# EasyEDA Pro project 作业1.eprj

# Schematic Schematic1
Board Name: Board1; Create Date: 2025-07-04; Page Name: P1; Project Name: 作业1; Schematic Name: Schematic1; Update Date: 2025-07-04; Company: 嘉立创EDA; Page Size: A4; Version: V1.0
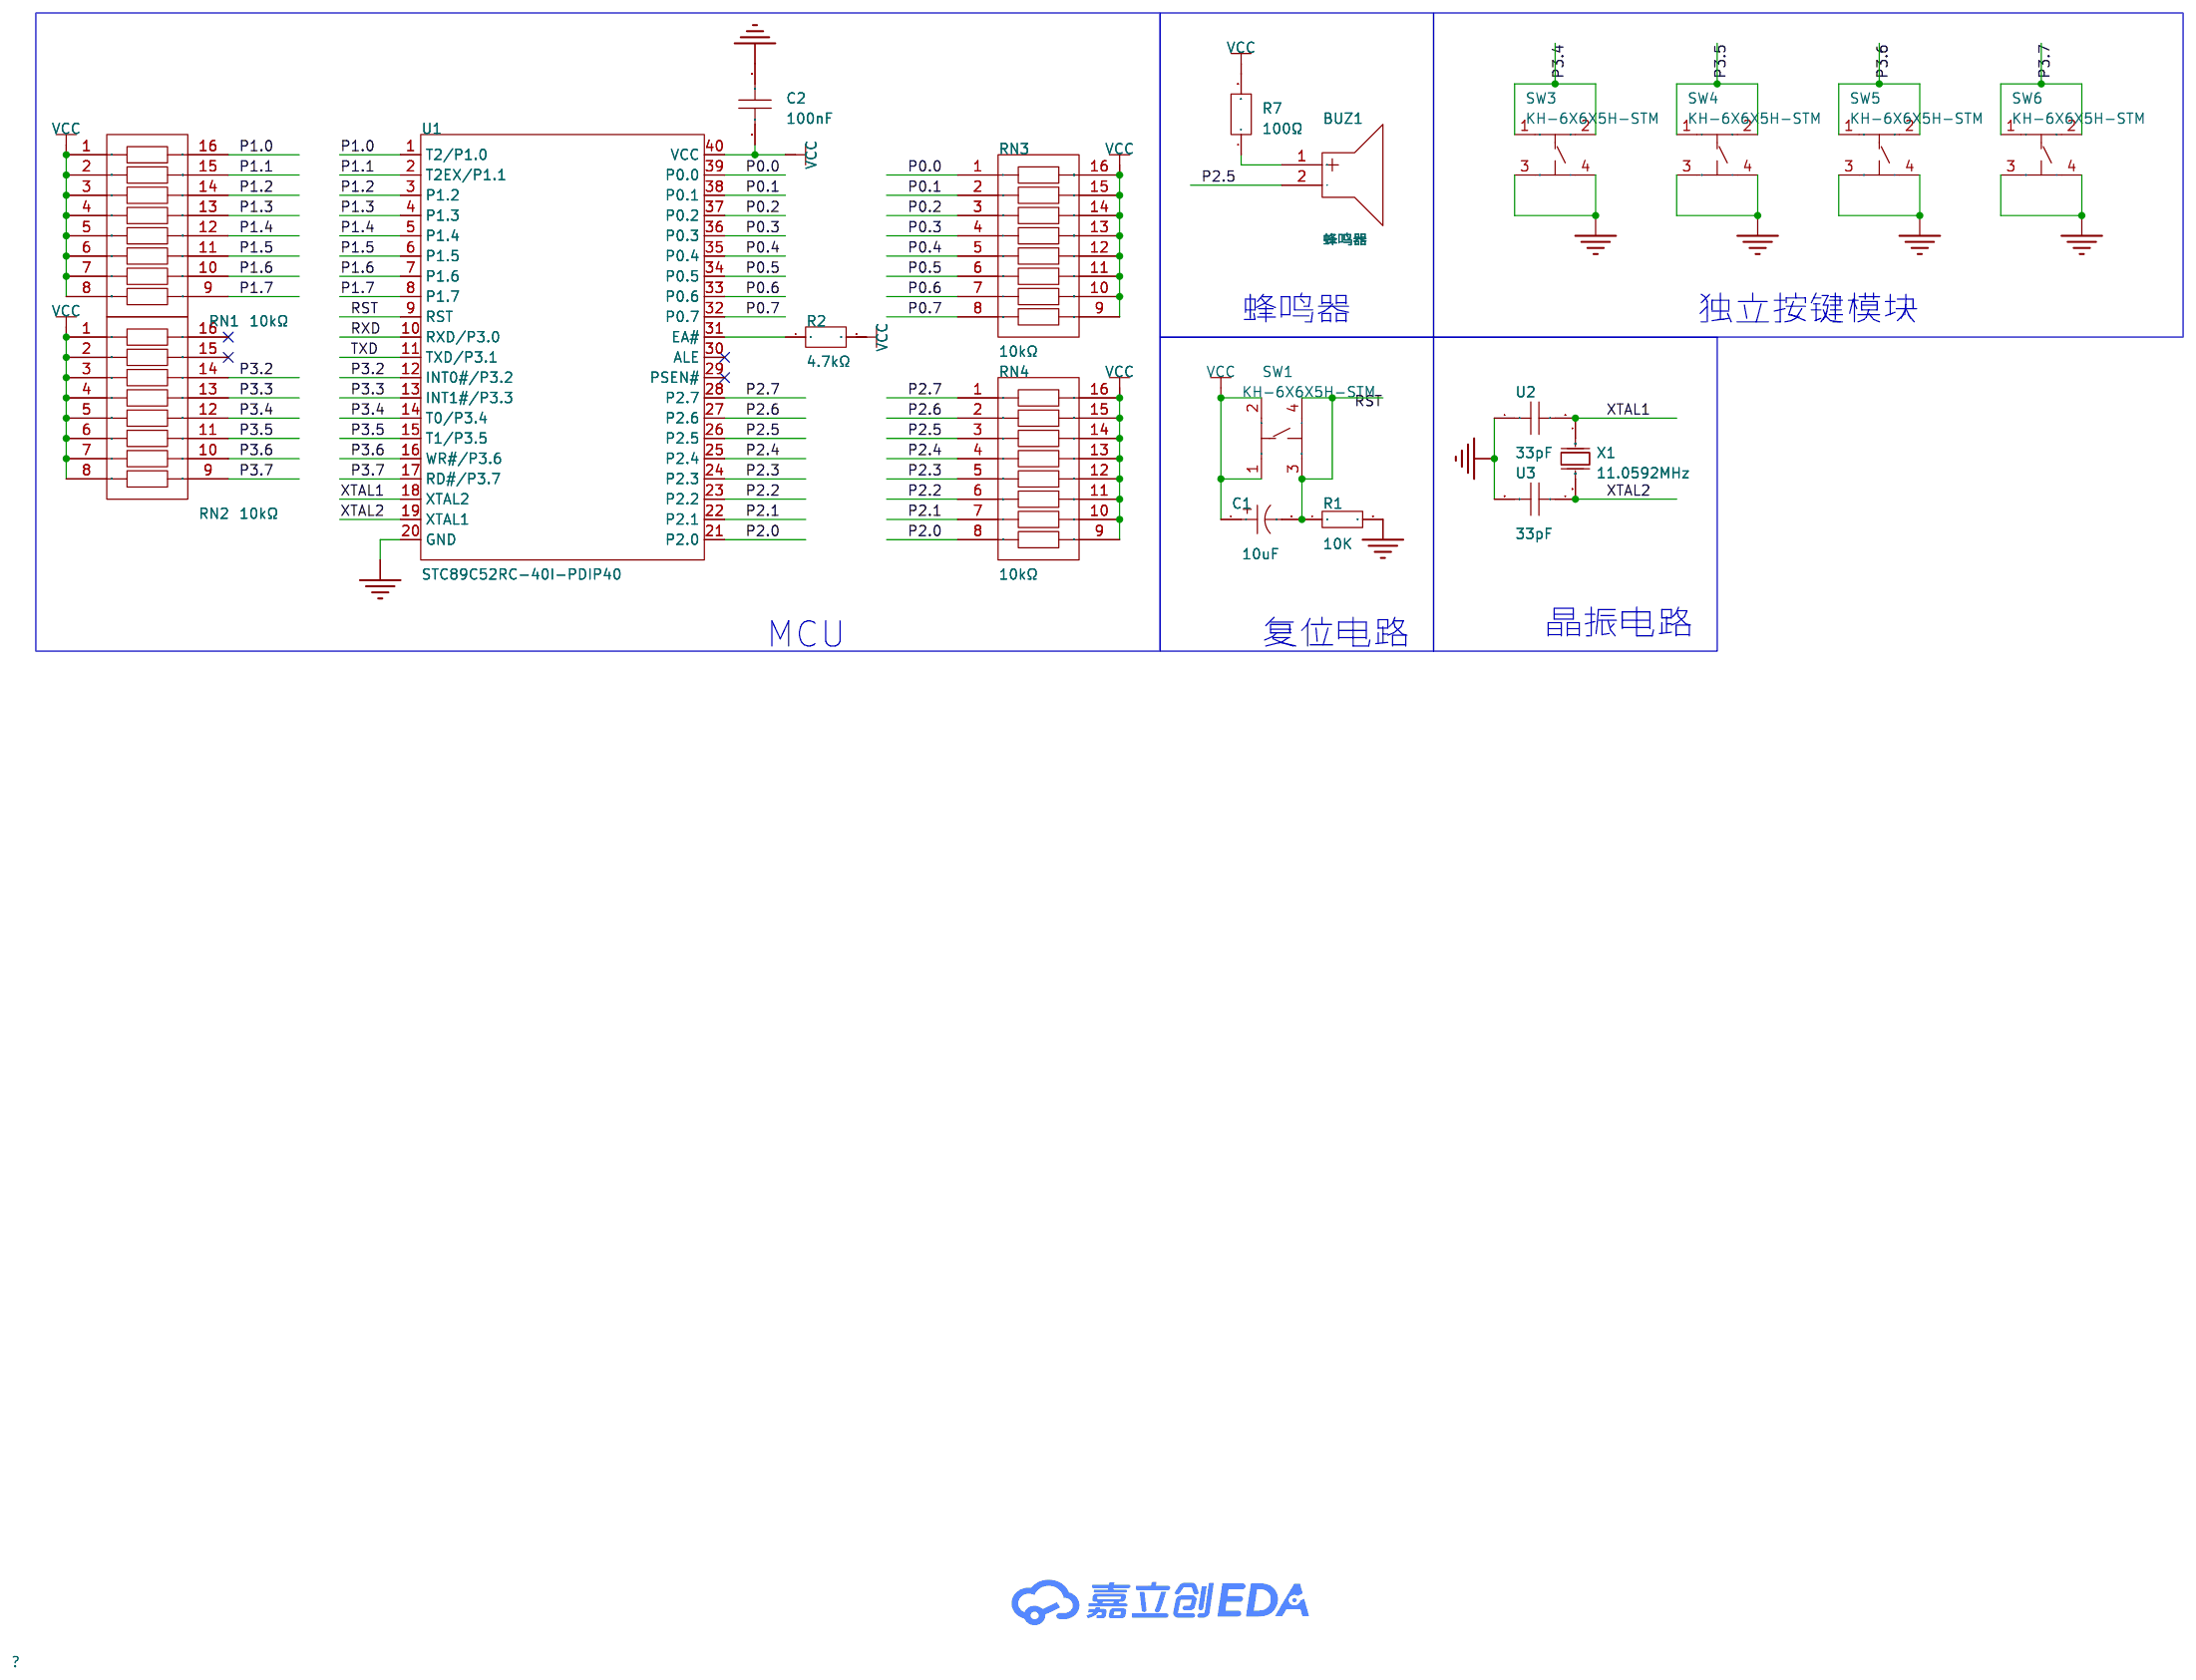
[diagram p0: schematic sheet]

## Parts
BUZ1  蜂鸣器  [BUZ-TH_BD9.0-P5.00-D0.6-FD]
C1  10uF  [CAP-TH_BD10.0-P5.00-D0.6-FD_1]
C2  100nF  [C0603]
R1  10K  [R0603]
R2  4.7kΩ  [R0805]
R7  100Ω  [R1206]
RN1  10kΩ  [DIP-16_L22.0-W6.7-P2.54-LS7.6-BL]
RN2  10kΩ  [DIP-16_L22.0-W6.7-P2.54-LS7.6-BL]
RN3  10kΩ  [DIP-16_L22.0-W6.7-P2.54-LS7.6-BL]
RN4  10kΩ  [DIP-16_L22.0-W6.7-P2.54-LS7.6-BL]
SW1  KH-6X6X5H-STM  [SW-SMD_4P-L6.0-W6.0-P4.50-LS9.0_H5.0]
SW3  KH-6X6X5H-STM  [SW-SMD_4P-L6.0-W6.0-P4.50-LS9.0_H5.0]
SW4  KH-6X6X5H-STM  [SW-SMD_4P-L6.0-W6.0-P4.50-LS9.0_H5.0]
SW5  KH-6X6X5H-STM  [SW-SMD_4P-L6.0-W6.0-P4.50-LS9.0_H5.0]
SW6  KH-6X6X5H-STM  [SW-SMD_4P-L6.0-W6.0-P4.50-LS9.0_H5.0]
U1  STC89C52RC-40I-PDIP40  [DIP-40_L52.0-W13.7-P2.54-LS15.2-BL]
U2  33pF  [C0603]
U3  33pF  [C0603]
X1  11.0592MHz  [HC-49US_L11.5-W4.5-P4.88]

## Library data of the parts
BUZ1 = 蜂鸣器: Supplier Part: C9900020875; Supplier Footprint: 插件; JLCPCB Part Class: 扩展库; Supplier: LCSC
C1 = CV100MPA16B: 容值:10uF;精度:±20%;额定电压:450V;纹波电流:200mA@100kHz;等效串联电阻(ESR):9Ω@100kHz;; LCSC Part Name: 10uF ±20% 450V; Supplier Part: C911241; Manufacturer: TWBOR(伯鸿); Supplier Footprint: 插件,D10xL16mm; JLCPCB Part Class: 扩展库; Datasheet: https://atta.szlcsc.com/upload/public/pdf/source/20201117/C911241_08C53D140102C9DE5D4425A5E1B3FE4F.pdf; Supplier: LCSC; Tolerance: ±20%; Voltage Rating: 450V; Ripple Current: 200mA@100kHz; Equivalent Series Resistance(ESR): 9Ω@100kHz; Pin Spacing: 5mm; Diameter: 10mm; Height - Seated (Max): 16mm; Lifetime: 5000hrs@105℃; Operating Temperature: -25℃~+105℃
C2 = 0603X7R104K250NT: 容值:100nF;精度:±10%;额定电压:25V;温度系数:X7R;; LCSC Part Name: 100nF ±10% 25V; Supplier Part: C48579280; Manufacturer: AIDE(爱迪电容); Supplier Footprint: 0603; JLCPCB Part Class: 扩展库; Datasheet: https://atta.szlcsc.com/upload/public/pdf/source/20210330/C2691711_5D01E1D4D7BF54205139C8425089DFE9.pdf; Supplier: LCSC; Tolerance: ±10%; Voltage Rating: 25V; Temperature Coefficient: X7R
R1 = Res_0603: Supplier Footprint: 0603
R2 = ERJ-U06F4701V: 电阻类型:厚膜电阻;阻值:4.7kΩ;精度:±1%;功率:125mW;工作电压:-;温度系数:±100ppm/℃;; LCSC Part Name: 4.7kΩ ±1% 125mW 厚膜电阻; Supplier Part: C1859462; Manufacturer: PANASONIC(松下); Supplier Footprint: 0805; JLCPCB Part Class: 扩展库; Datasheet: https://atta.szlcsc.com/upload/public/pdf/source/20210624/C1859462_0DC8A541405FCF91B34CFE3F505433C6.pdf; Supplier: LCSC; Type: 厚膜电阻; Tolerance: ±1%; Power(Watts): 125mW; Temperature Coefficient: ±100ppm/℃; Operating Temperature: -55℃~+155℃
R7 = CQ06W4J0101T5E: 电阻类型:-;阻值:100Ω;精度:±5%;功率:250mW;工作电压:200V;; LCSC Part Name: 100Ω ±5% 250mW; Supplier Part: C2765667; Manufacturer: UNI-ROYAL(厚声); Supplier Footprint: 1206; JLCPCB Part Class: 扩展库; Datasheet: https://atta.szlcsc.com/upload/public/pdf/source/20210330/C2758625_90D19EEA9B8C23AA9BAF71D52BD1DB3E.pdf; Supplier: LCSC; Tolerance: ±5%; Power(Watts): 250mW; Voltage-Supply(Max): 200V; Operating Temperature: -55℃~+155℃
RN1-RN4 = 4116R-1-103LF: 电阻器数:8;阻值:10kΩ;精度:±2%;单个元件功率:250mW;温度系数:±100ppm/℃;; LCSC Part Name: 10kΩ ±2%; Supplier Part: C6087381; Manufacturer: BOURNS; Supplier Footprint: DIP-16; Datasheet: https://atta.szlcsc.com/upload/public/pdf/source/20210630/3D9C012B231BA1D1C9C6139B97130D1A.pdf; Supplier: LCSC; Number of Resistors: 8; Tolerance: ±2%; Power(Watts): 250mW; Temperature Coefficient: ±100ppm/℃; Number of Pins: 16
SW1 SW3-SW6 = KH-6X6X5H-STM: 电路结构:单刀单掷;按钮形状:圆形按钮;安装方式:立贴;开关长度:6mm;开关宽度:6mm;开关高度:5mm;带支架:不带;触点电流:50mA;额定电压(DC):12V;机械寿命:8万次;; LCSC Part Name: 6*6*5mm 立贴 轻触开关; Supplier Part: C2837531; Manufacturer: kinghelm(金航标); Supplier Footprint: SMD; JLCPCB Part Class: 扩展库; Datasheet: https://atta.szlcsc.com/upload/public/pdf/source/20210608/C2837531_45E87AB996CE723B09405FF2EA209C4C.pdf; Supplier: LCSC; Circuit: 单刀单掷; Actuator Style: 圆形按钮; Mounting Style: 立贴; Switch Length: 6mm; Switch Width: 6mm; Switch Height: 5mm; Strike Gundam: 不带; Contact Current: 50mA; Voltage Rating (DC): 12V; Actuator/Cap Color: 黑色; Pin Style: 鸥翼型; Mechanical Life: 8万次
U1 = STC89C52RC-40I-PDIP40: CPU内核:51系列;应用领域:-;; Supplier Part: C14022; Manufacturer: STC; Supplier Footprint: DIP-40; JLCPCB Part Class: 扩展库; Datasheet: https://atta.szlcsc.com/upload/public/pdf/source/20250219/C2F0DDDE7C5E9ADA5B33742D18630F09.pdf; Supplier: LCSC; CPU Core: 51系列; Program Storage Size: 8KB; Program Memory Type: FLASH; Number of I/O: 35; Voltage - Supply: 3.3V~5.5V
U2 U3 = GRM1885C1H330FA01D: 容值:33pF;精度:±1%;额定电压:50V;温度系数:-;; LCSC Part Name: 33pF ±1% 50V; Supplier Part: C882522; Manufacturer: muRata(村田); Supplier Footprint: 0603; JLCPCB Part Class: 扩展库; Datasheet: https://atta.szlcsc.com/upload/public/pdf/source/20200305/C490387_23319AE8C154DEB24C505E6C82A8106A.pdf; Supplier: LCSC; Tolerance: ±1%; Voltage Rating: 50V
X1 = X49SD110592MSD2SC: 晶振类型:直插晶振;频率:11.0592MHz;常温频差:±20ppm;负载电容:20pF;频率稳定度:±30ppm;; LCSC Part Name: HC-49US 11.0592MHZ 2P 49S 20PF ±20PPM -20~70℃（±30PPM）; Supplier Part: C2203; Manufacturer: YXC(扬兴晶振); Supplier Footprint: HC-49S; JLCPCB Part Class: 扩展库; Datasheet: https://atta.szlcsc.com/upload/public/pdf/source/20240329/977D7F2434F98B2BE33270BB9FF3D86D.pdf; Supplier: LCSC; Type: 直插晶振; Normal temperature Frequency Tolerance: ±20ppm; Load Capacitance: 20pF; Frequency Stability: ±30ppm; Operating Temperature: -20℃~+70℃

## Nets
GND: C2.2 R1.2 SW3.3 SW3.4 SW4.3 SW4.4 SW5.3 SW5.4 SW6.3 SW6.4 U1.20(GND) U2.1 U3.2
VCC: C1.1 C2.1 R2.2 R7.2 RN1.1 RN1.2 RN1.3 RN1.4 RN1.5 RN1.6 RN1.7 RN1.8 RN2.1 RN2.2 RN2.3 RN2.4 RN2.5 RN2.6 RN2.7 RN2.8 RN3.9 RN3.10 RN3.11 RN3.12 RN3.13 RN3.14 RN3.15 RN3.16 RN4.9 RN4.10 RN4.11 RN4.12 RN4.13 RN4.14 RN4.15 RN4.16 SW1.1 SW1.2 U1.40(VCC)
P0.0: RN3.1 U1.39(P0.0)
P0.1: RN3.2 U1.38(P0.1)
P0.2: RN3.3 U1.37(P0.2)
P0.3: RN3.4 U1.36(P0.3)
P0.4: RN3.5 U1.35(P0.4)
P0.5: RN3.6 U1.34(P0.5)
P0.6: RN3.7 U1.33(P0.6)
P0.7: RN3.8 U1.32(P0.7)
P1.0: RN1.16 U1.1(T2/P1.0)
P1.1: RN1.15 U1.2(T2EX/P1.1)
P1.2: RN1.14 U1.3(P1.2)
P1.3: RN1.13 U1.4(P1.3)
P1.4: RN1.12 U1.5(P1.4)
P1.5: RN1.11 U1.6(P1.5)
P1.6: RN1.10 U1.7(P1.6)
P1.7: RN1.9 U1.8(P1.7)
P2.0: RN4.8 U1.21(P2.0)
P2.1: RN4.7 U1.22(P2.1)
P2.2: RN4.6 U1.23(P2.2)
P2.3: RN4.5 U1.24(P2.3)
P2.4: RN4.4 U1.25(P2.4)
P2.5: BUZ1.2(-) RN4.3 U1.26(P2.5)
P2.6: RN4.2 U1.27(P2.6)
P2.7: RN4.1 U1.28(P2.7)
P3.2: RN2.14 U1.12(INT0#/P3.2)
P3.3: RN2.13 U1.13(INT1#/P3.3)
P3.4: RN2.12 SW3.1 SW3.2 U1.14(T0/P3.4)
P3.5: RN2.11 SW4.1 SW4.2 U1.15(T1/P3.5)
P3.6: RN2.10 SW5.1 SW5.2 U1.16(WR#/P3.6)
P3.7: RN2.9 SW6.1 SW6.2 U1.17(RD#/P3.7)
RST: C1.2 R1.1 SW1.3 SW1.4 U1.9(RST)
RXD: U1.10(RXD/P3.0)
TXD: U1.11(TXD/P3.1)
XTAL1: U1.18(XTAL2) U2.2 X1.1(OSC1)
XTAL2: U1.19(XTAL1) U3.1 X1.2(OSC2)
$1N692: R2.1 U1.31(EA#)
$1N910: BUZ1.1(+) R7.1

Not connected (* = marked no-connect by the designer): RN2 15* 16*; U1 29(PSEN#)* 30(ALE)*

## Notes on the sheet
- 蜂鸣器
- 独立按键模块
- 晶振电路
- MCU
- 复位电路

# Board PCB1
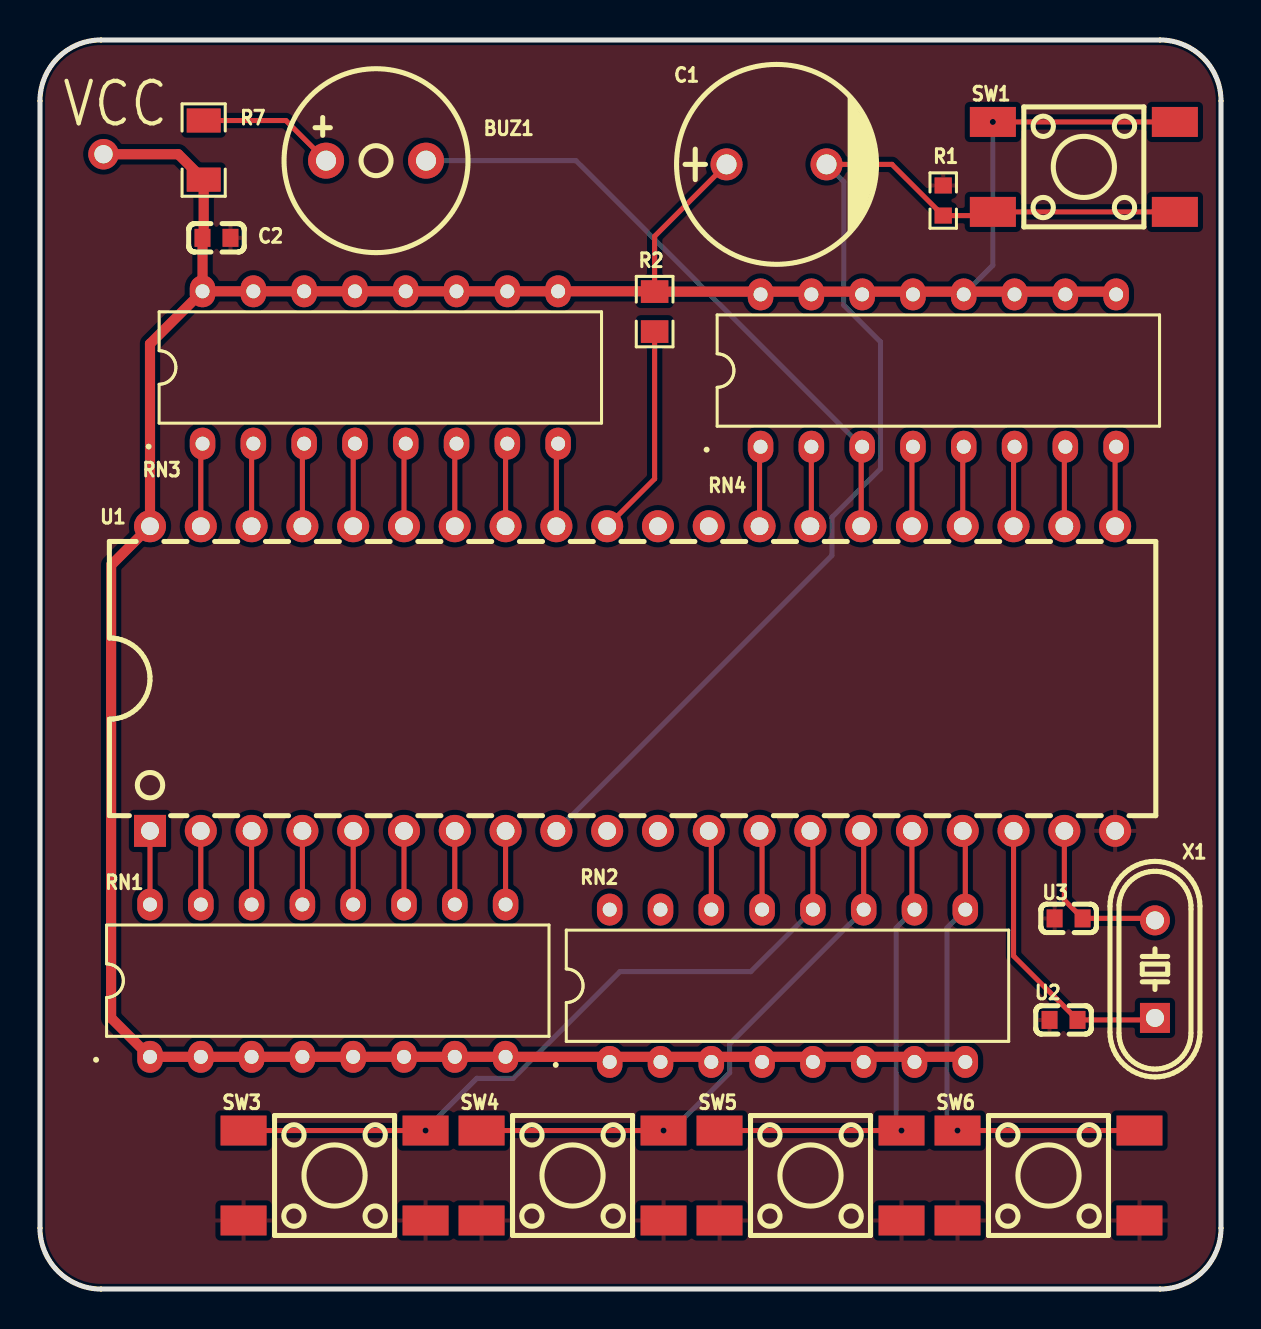
[diagram p1: board, top side]
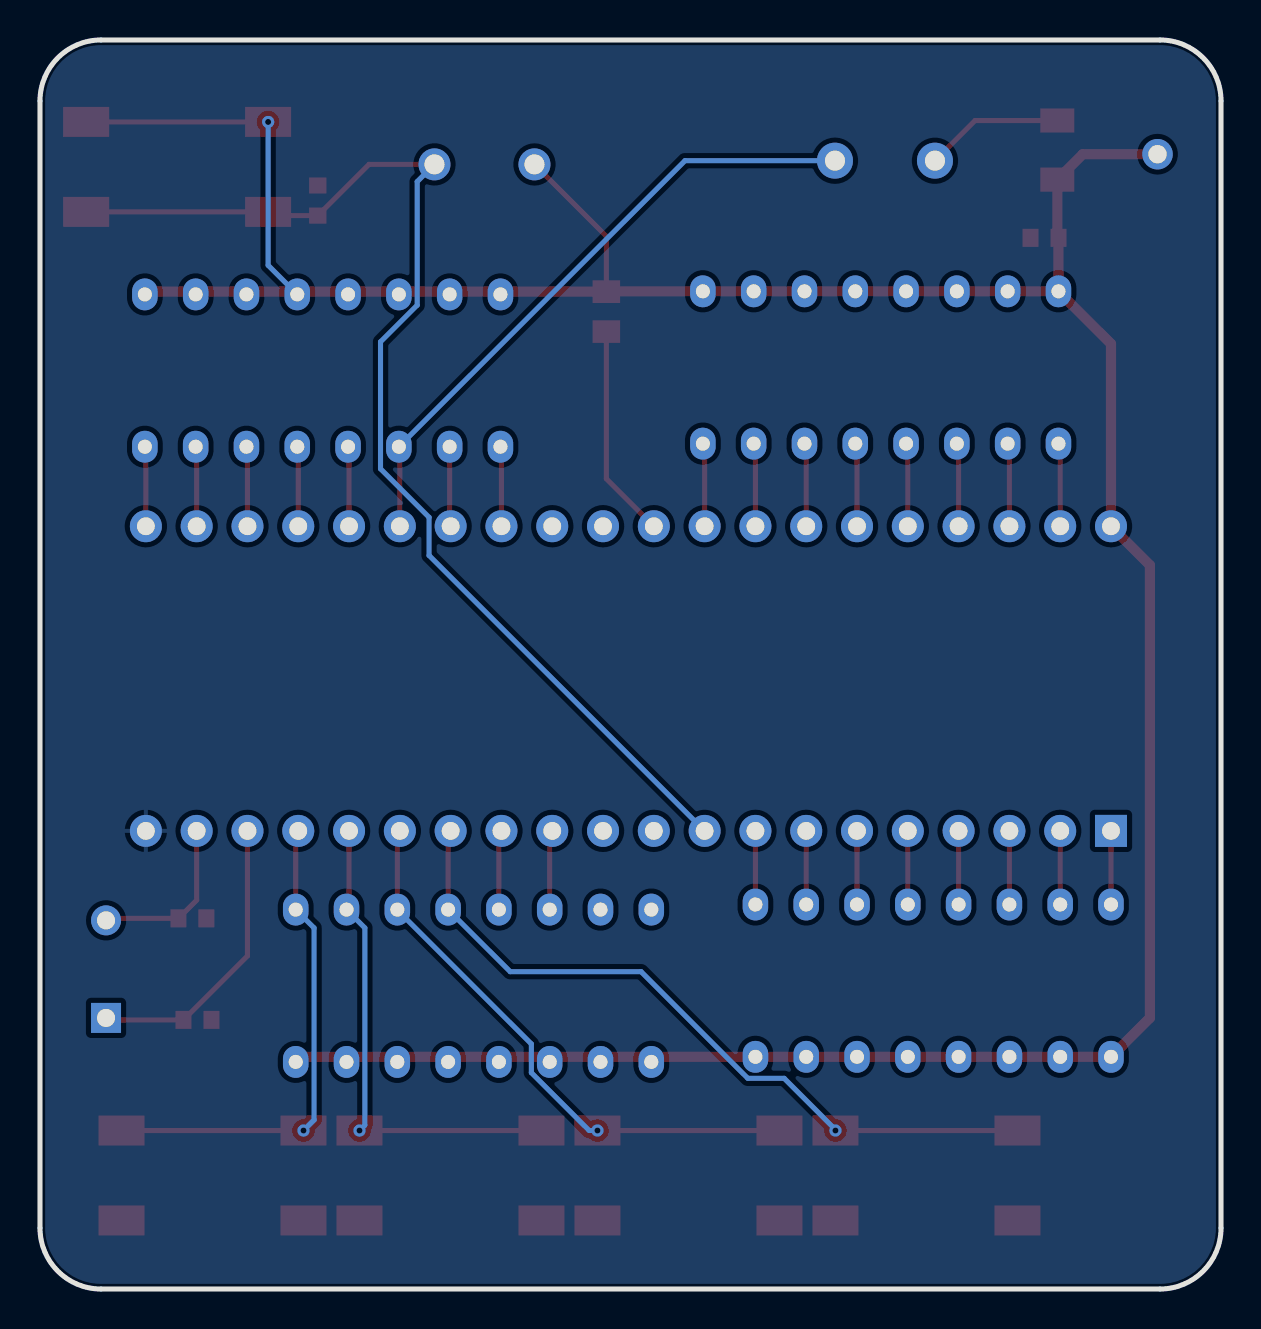
[diagram p2: board, bottom side, seen from below]

Outline 59.05 x 62.48 mm; copper layers: Top Layer, Bottom Layer. Coordinates in mm from the lower left corner of the outline.
Outline path: 0,59.44 0,3.05 arc(0.89,0.89) 3.05,0 56.01,0 arc(58.16,0.89) 59.05,3.05 59.05,59.44 arc(58.16,61.59) 56.01,62.48 3.05,62.48 arc(0.89,61.59) 0,59.44
Stack: Top Layer 0.035mm / Dielectric1 1.51mm FR4 er 4.5 / Bottom Layer 0.035mm

## Design rules (mm)
template: JLCPCB Capability(Two Layers Board)
spacing copperThickness1oz (default): track to track 0.102, other pairs 0.152 to 0.3
spacing copperThickness2oz: track to track 0.203, other pairs 0.152 to 0.3
track width copperThickness1oz (default): min 0.127, default 0.254, max 2.54
track width copperThickness2oz: min 0.203, default 0.254, max 2.54
differential pair differentialPair (default): width min 0.127, default 0.254, max 2.54; gap min 0.152, default 0.152
via viaSize (default): diameter min 0.5, default 0.61, max 10; hole min 0.3, default 0.305, max 6.3

## Placement (name value [footprint] x y rotation side)
BUZ1  蜂鸣器  [BUZ-TH_BD9.0-P5.00-D0.6-FD]  16.8 56.45 0 top
C1  10uF  [CAP-TH_BD10.0-P5.00-D0.6-FD_1]  36.83 56.26 0 top
C2  100nF  [C0603]  8.83 52.59 0 top
NOREF  -  [Pad_e14]  3.17 56.77 0 top
R1  10K  [R0603]  45.16 54.45 90 top
R2  4.7kΩ  [R0805]  30.73 48.89 90 top
R7  100Ω  [R1206]  8.18 56.98 270 top
RN1  10kΩ  [DIP-16_L22.0-W6.7-P2.54-LS7.6-BL]  14.39 15.43 0 top
RN2  10kΩ  [DIP-16_L22.0-W6.7-P2.54-LS7.6-BL]  37.38 15.17 0 top
RN3  10kΩ  [DIP-16_L22.0-W6.7-P2.54-LS7.6-BL]  17.02 46.1 0 top
RN4  10kΩ  [DIP-16_L22.0-W6.7-P2.54-LS7.6-BL]  44.92 45.95 0 top
SW1  KH-6X6X5H-STM  [SW-SMD_4P-L6.0-W6.0-P4.50-LS9.0_H5.0]  52.2 56.13 0 top
SW3  KH-6X6X5H-STM  [SW-SMD_4P-L6.0-W6.0-P4.50-LS9.0_H5.0]  14.73 5.68 0 top
SW4  KH-6X6X5H-STM  [SW-SMD_4P-L6.0-W6.0-P4.50-LS9.0_H5.0]  26.63 5.68 0 top
SW5  KH-6X6X5H-STM  [SW-SMD_4P-L6.0-W6.0-P4.50-LS9.0_H5.0]  38.53 5.68 0 top
SW6  KH-6X6X5H-STM  [SW-SMD_4P-L6.0-W6.0-P4.50-LS9.0_H5.0]  50.43 5.68 0 top
U1  STC89C52RC-40I-PDIP40  [DIP-40_L52.0-W13.7-P2.54-LS15.2-BL]  29.63 30.54 0 top
U2  33pF  [C0603]  51.18 13.46 0 top
U3  33pF  [C0603]  51.43 18.54 180 top
X1  11.0592MHz  [HC-49US_L11.5-W4.5-P4.88]  55.75 16 90 top

## Footprints (pads in the part's own frame, mm; a bottom-side part is the same pattern mirrored in y, then rotated)
BUZ-TH_BD9.0-P5.00-D0.6-FD
  round 1.8 hole 1: 1(-2.5,0) 2(2.5,0)
C0603
  rect 0.8x0.9 smd: 1(-0.7,0) 2(0.7,0)
CAP-TH_BD10.0-P5.00-D0.6-FD_1
  round 1.6 hole 1: 1(-2.5,0) 2(2.5,0)
DIP-16_L22.0-W6.7-P2.54-LS7.6-BL
  oval 1.276x1.595 hole 0.7: 1(-8.89,-3.81) 2(-6.35,-3.81) 3(-3.81,-3.81) 4(-1.27,-3.81) 5(1.27,-3.81) 6(3.81,-3.81) 7(6.35,-3.81) 8(8.89,-3.81) 9(8.89,3.81) 10(6.35,3.81) 11(3.81,3.81) 12(1.27,3.81) 13(-1.27,3.81) 14(-3.81,3.81) 15(-6.35,3.81) 16(-8.89,3.81)
DIP-40_L52.0-W13.7-P2.54-LS15.2-BL
  rect 1.6x1.6 hole 0.889: 1(-24.13,-7.62)
  round 1.6 hole 0.889: 2(-21.59,-7.62) 3(-19.05,-7.62) 4(-16.51,-7.62) 5(-13.97,-7.62) 6(-11.43,-7.62) 7(-8.89,-7.62) 8(-6.35,-7.62) 9(-3.81,-7.62) 10(-1.27,-7.62) 11(1.27,-7.62) 12(3.81,-7.62) 13(6.35,-7.62) 14(8.89,-7.62) 15(11.43,-7.62) 16(13.97,-7.62) 17(16.51,-7.62) 18(19.05,-7.62) 19(21.59,-7.62) 20(24.13,-7.62) 21(24.13,7.62) 22(21.59,7.62) 23(19.05,7.62) 24(16.51,7.62) 25(13.97,7.62) 26(11.43,7.62) 27(8.89,7.62) 28(6.35,7.62) 29(3.81,7.62) 30(1.27,7.62) 31(-1.27,7.62) 32(-3.81,7.62) 33(-6.35,7.62) 34(-8.89,7.62) 35(-11.43,7.62) 36(-13.97,7.62) 37(-16.51,7.62) 38(-19.05,7.62) 39(-21.59,7.62) 40(-24.13,7.62)
HC-49US_L11.5-W4.5-P4.88
  rect 1.5x1.5 hole 0.9: 1(-2.44,0)
  round 1.5 hole 0.9: 2(2.44,0)
Pad_e14
  round 1.524 hole 0.914: 1(0,0)
R0603
  rect 0.806x0.864 smd: 1(-0.753,0) 2(0.753,0)
R0805
  rect 1.133x1.377 smd: 1(-1,0) 2(1,0)
R1206
  rect 1.208x1.701 smd: 1(-1.479,0) 2(1.479,0)
SW-SMD_4P-L6.0-W6.0-P4.50-LS9.0_H5.0
  rect 2.3x1.5 smd: 1(-4.55,2.25) 2(4.55,2.25) 3(-4.55,-2.25) 4(4.55,-2.25)

## Nets
As in the schematic, except:
VCC: C1.1 C2.1 NOREF.1 R2.2 R7.2 RN1.1 RN1.2 RN1.3 RN1.4 RN1.5 RN1.6 RN1.7 RN1.8 RN2.1 RN2.2 RN2.3 RN2.4 RN2.5 RN2.6 RN2.7 RN2.8 RN3.9 RN3.10 RN3.11 RN3.12 RN3.13 RN3.14 RN3.15 RN3.16 RN4.9 RN4.10 RN4.11 RN4.12 RN4.13 RN4.14 RN4.15 RN4.16 SW1.1 SW1.2 U1.40

Pads without a net: RN2 15 16; U1 29 30

## Via types
v1: diameter 0.61, hole 0.305, Top Layer to Bottom Layer, 5 vias

## Routing (per net, layer and track width the routed paths; a pad name or vN(x,y) marks a point on that pad's centre or on a via; arc(x,y) is an arc through that point)
VCC: length 164.9
  Top Layer w0.254: C1.1 30.73,52.66 R2.2 ; v1(47.65,58.38) SW1.2
  Top Layer w0.508: RN3.16 8.13,52.58 C2.1 8.18,52.65 R7.2 6.91,56.77 NOREF.1 ; RN3.16 RN3.15 RN3.14 RN3.13 RN3.12 RN3.11 RN3.10 RN3.9 30.72,49.91 R2.2 53.67,49.89 RN4.9 ; RN3.16 5.5,47.28 U1.40 3.56,36.21 3.56,13.56 RN1.1 RN1.2 RN1.3 RN1.4 RN1.5 RN1.6 RN1.7 RN1.8 46.01,11.62 46.27,11.36
  Bottom Layer w0.254: RN4.12 47.65,51.21 v1(47.65,58.38)
P0.0: length 4.2
  Top Layer w0.254: RN3.1 8.04,42.2 U1.39
P0.1: length 4.2
  Top Layer w0.254: RN3.2 10.58,42.2 U1.38
P0.2: length 4.2
  Top Layer w0.254: U1.37 13.12,42.2 RN3.3
P0.3: length 4.2
  Top Layer w0.254: U1.36 15.66,42.2 RN3.4
P0.4: length 4.2
  Top Layer w0.254: U1.35 18.2,42.2 RN3.5
P0.5: length 4.2
  Top Layer w0.254: U1.34 20.74,42.2 RN3.6
P0.6: length 4.2
  Top Layer w0.254: RN3.7 23.28,42.2 U1.33
P0.7: length 4.2
  Top Layer w0.254: RN3.8 25.82,42.2 U1.32
P1.0: length 3.7
  Top Layer w0.254: RN1.16 U1.1
P1.1: length 3.7
  Top Layer w0.254: RN1.15 U1.2
P1.2: length 3.7
  Top Layer w0.254: RN1.14 U1.3
P1.3: length 3.7
  Top Layer w0.254: RN1.13 U1.4
P1.4: length 3.7
  Top Layer w0.254: RN1.12 U1.5
P1.5: length 3.7
  Top Layer w0.254: RN1.11 U1.6
P1.6: length 3.7
  Top Layer w0.254: RN1.10 U1.7
P1.7: length 3.7
  Top Layer w0.254: RN1.9 U1.8
P2.0: length 4
  Top Layer w0.254: RN4.8 53.76,42.09 U1.21
P2.1: length 4
  Top Layer w0.254: U1.22 51.22,42.09 RN4.7
P2.2: length 4
  Top Layer w0.254: RN4.6 48.68,42.09 U1.23
P2.3: length 4
  Top Layer w0.254: RN4.5 46.14,42.09 U1.24
P2.4: length 4
  Top Layer w0.254: RN4.4 43.6,42.09 U1.25
P2.5: length 31.7
  Top Layer w0.254: U1.26 41.06,42.09 RN4.3
  Bottom Layer w0.254: RN4.3 26.8,56.45 BUZ1.2
P2.6: length 4
  Top Layer w0.254: RN4.2 38.57,38.21 U1.27
P2.7: length 4
  Top Layer w0.254: RN4.1 36.03,41.49 35.98,41.44 U1.28
P3.2: length 4
  Top Layer w0.254: U1.12 33.57,22.79 RN2.14
P3.3: length 4
  Top Layer w0.254: U1.13 36.11,22.79 RN2.13
P3.4: length 37.1
  Top Layer w0.254: 38.65,18.98 38.65,22.79 U1.14 ; SW3.1 v1(19.28,7.93)
  Bottom Layer w0.254: v1(19.28,7.93) 19.28,7.98 21.84,10.54 23.66,10.54 29,15.87 35.54,15.87 38.65,18.98
P3.5: length 28.5
  Top Layer w0.254: SW4.1 v1(31.18,7.93) ; RN2.11 41.19,22.79 U1.15
  Bottom Layer w0.254: RN2.11 41.19,18.96 34.48,12.26 34.48,10.82 31.59,7.93 v1(31.18,7.93)
P3.6: length 24.6
  Top Layer w0.254: U1.16 43.6,19.11 RN2.10 ; SW5.1 v1(43.08,7.93)
  Bottom Layer w0.254: v1(43.08,7.93) 42.81,8.2 42.81,18.06 RN2.10
P3.7: length 24.7
  Top Layer w0.254: 46.27,18.98 46.27,22.79 U1.17 ; v1(45.88,7.93) SW6.2
  Bottom Layer w0.254: v1(45.88,7.93) 45.35,8.46 45.35,18.06 46.27,18.98
RST: length 59.7
  Top Layer w0.254: SW1.4 SW1.3 47.46,53.7 R1.1 42.6,56.26 C1.2
  Bottom Layer w0.254: C1.2 40.19,55.4 40.19,49.22 42.03,47.38 42.03,41.03 39.6,38.61 39.6,36.7 U1.9
XTAL1: length 14.7
  Top Layer w0.254: U1.18 48.68,16.66 U2.2 55.65,13.46 X1.1
XTAL2: length 8.4
  Top Layer w0.254: U1.19 51.22,19.46 U3.1 55.65,18.54 X1.2
$1N692: length 10.7
  Top Layer w0.254: R2.1 30.73,40.53 U1.31
$1N910: length 7
  Top Layer w0.254: R7.1 12.3,58.46 BUZ1.1

## Copper pours and planes (outline as drawn; the poured copper is in the pictures)
GND on Top Layer: 0,62.48 59.05,62.48 59.05,-0.13 0,-0.13
GND on Bottom Layer: 0,62.48 59.18,62.48 59.18,-0.25 0,-0.25

## Text on the board
Top Silkscreen Layer: VCC
